# Altium schematic sheet usb.SchDoc
size A
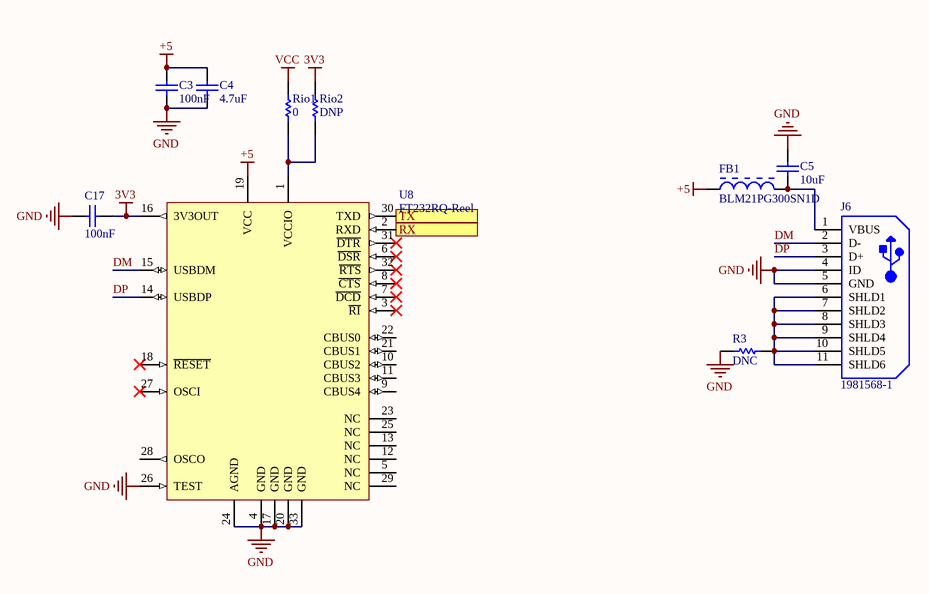
[diagram p0: usb.SchDoc]

## Parts
C3  value 100nF  [0402]  (hidden comment: Cap)
C4  value 4.7uF  [0402]  (hidden comment: Cap)
C5  value 10uF  [0402]  (hidden comment: Cap)
C17  value 100nF  [0402]  (hidden comment: Cap)
FB1  BLM21PG300SN1D  [MURA-BLM21-B40-CHIP-2_V2]
J6  1981568-1  [TECO-1981568-5_V]
R3  value DNC  [0402]  (hidden comment: Res)
Rio1  value 0  [0402]  (hidden comment: Res)
Rio2  value DNP  [0402]  (hidden comment: Res)
U8  FT232RQ-Reel  [PQFN5X5-32_V]

## Ports
RX (in), TX (out)

## Nets
3V3: C17.2 Rio2.2 U8.16(3V3OUT)
+5: C3.2 C4.2 FB1.1 U8.19(VCC)
GND: C3.1 C4.1 C5.2 C17.1 J6.4(ID) J6.5(GND) R3.1 U8.4(GND) U8.17(GND) U8.20(GND) U8.24(AGND) U8.26(TEST) U8.33(GND)
VCC: Rio1.2
DM: J6.2(D-) U8.15(USBDM)
DP: J6.3(D+) U8.14(USBDP)
RX: U8.2(RXD) ; port RX
TX: U8.30(TXD) ; port TX
NetC5_1: C5.1 FB1.2 J6.1(VBUS)
NetJ6_6: J6.6(SHLD1) J6.7(SHLD2) J6.8(SHLD3) J6.9(SHLD4) J6.10(SHLD5) J6.11(SHLD6) R3.2
NetRio1_1: Rio1.1 Rio2.1 U8.1(VCCIO)

Not connected (* = marked no-connect by the designer): U8 3(~{RI})* 5(NC) 6(~{DSR})* 7(~{DCD})* 8(~{CTS})* 9(CBUS4) 10(CBUS2) 11(CBUS3) 12(NC) 13(NC) 18(~{RESET})* 21(CBUS1) 22(CBUS0) 23(NC) 25(NC) 27(OSCI)* 28(OSCO) 29(NC) 31(~{DTR})* 32(~{RTS})*

## Library data of the parts
C3-C5 C17 = Cap: Ceramic Capacitor (Surface Mount); Manufacturer: Generic Ceramic Chip Cap (TBD); Digi-Key Part Number: *; Manufacturer Part Number: *; Note: *; Rating: *
FB1 = CMP-0686-00620-2: Chip Ferrite Bead for Power Lines, 30 Ohm, 4000 mA, -55 to 125 degC, 2 x 1.25 x 1.05 mm SMD, Tape and Reel; Manufacturer: Murata; DC Resistance: 0.014 Ohm Max.; Rated Current: 4000 mA; Impedance (at 100 MHz): 30 Ohm Typ.; ComponentLink3Description: Package Specification; Packing: Tape and Reel; ComponentLink3URL: http://www.murata.com/products/catalog/pdf/c31e.pdf; PackageDescription: 2-Pin Chip, Body 2 x 1.25 mm; DatasheetVersion: 08/2013; ComponentLink2Description: Datasheet; ComponentLink1Description: Manufacturer URL; PartNumber: BLM21PG300SN1D; PackageReference: BLM21_H1050-2; Mounting Technology: Surface Mount; ComponentLink1URL: http://www.murata.com/; Operating Temperature Range: -55 to 125 degC; ComponentLink2URL: http://www.murata.com/products/catalog/pdf/c31e.pdf
J6 = CMP-2000-05408-1: Micro USB Receptacle Standard Type B Assy, 5-Pin SMD, RoHS, Tape and Reel; Manufacturer: TE Connectivity; Body Orientation: RightAngle; Number of Ports: 1Port; Number of Contacts: 5POS; Gender: RCP; Voltage Rating Max: 30VAC; Product Depth (mm): 5.6mm; Pitch (mm): 0.65mm; Current Rating (Max): 1/ContactA; Product Length (mm): 8mm; Product Height (mm): 3mm; Operating Temperature Max Deg. C: 85C; Datasheet URL: http://www.mouser.com/ds/2/418/NG_CD_1981568_E2-621296.pdf; Termination Method: Solder; Number of Terminals: 5; Operating Temp Range: -55Cto85C; Mounting Style: SurfaceMount; Manufacturer URL: http://www.te.com/; Contact Material: CopperAlloy; Packaging: TapeandReel; Datasheet Version: Rev. E2, 08/2015; Operating Temperature Min Deg. C: -55C; Housing Material: Thermoplastic; Type: MicroUSB; Contact Plating: GoldOverNickel
R3 Rio1 Rio2 = Res: Chip Resistor (Surface Mount); Manufacturer: Generic Chip Res (TBD); Manufacturer Part Number: *; Digi-Key Part Number: *; Rating: *
U8 = CMP-0078-00009-3: USB UART Asynchronous Serial Data Transfer Chip, 32-pin QFN, Tape and Reel; Manufacturer: FTDI; ComponentLink1URL: http://www.ftdichip.com/; RevisionNote: DatasheetVersion updated to 2.10 Mar-2012; ComponentLink1Description: Manufacturer URL; PackageReference: PQFN5X5-32; PackageDescription: 32-Pin Quad Flat No-Lead 0.5 mm Pitch, Pullback, 3.2 x 3.2 mm Exposed Pad; DatasheetVersion: ver 2.10, Mar-2012; PartNumber: FT232RQ-Reel; ComponentLink2URL: http://www.ftdichip.com/Support/Documents/DataSheets/ICs/DS_FT232R.pdf; PackageVersion: Mar-12; ComponentLink2Description: Datasheet